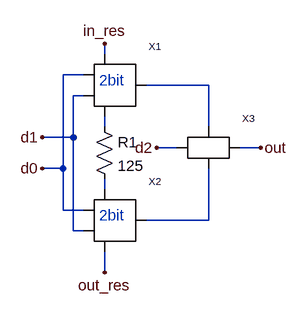
[diagram p0: schematic level2.asc]
level2.asc, the LTspice schematic file:
Version 4
SHEET 1 880 680
WIRE 144 64 144 48
WIRE 112 96 80 96
WIRE 304 112 208 112
WIRE 112 128 96 128
WIRE 144 176 144 160
WIRE 304 176 304 112
WIRE 96 192 96 128
WIRE 96 192 48 192
WIRE 256 208 224 208
WIRE 384 208 352 208
WIRE 80 240 80 96
WIRE 80 240 48 240
WIRE 144 272 144 256
WIRE 80 304 80 240
WIRE 112 304 80 304
WIRE 304 320 304 240
WIRE 304 320 208 320
WIRE 96 336 96 192
WIRE 112 336 96 336
WIRE 144 400 144 368
FLAG 144 48 in_res
FLAG 144 400 out_res
FLAG 384 208 out
FLAG 224 208 d2
FLAG 48 192 d1
FLAG 48 240 d0
SYMBOL level1 160 112 R0
SYMATTR InstName X1
SYMBOL level1 160 320 R0
SYMATTR InstName X2
SYMBOL switch 304 208 R0
SYMATTR InstName X3
SYMBOL res 128 160 R0
SYMATTR InstName R1
SYMATTR Value 125
TEXT 136 104 Left 2 ;2bit
TEXT 136 312 Left 2 ;2bit

The netlist it stands for:
* level2.asc
XX1 in_res N002 N001 d0 d1 level1  ; pins in_pin out_pin out_v d0 d1
XX2 N003 out_res N004 d0 d1 level1  ; pins in_pin out_pin out_v d0 d1
XX3 d2 N001 N004 out switch  ; pins dig_in in_1 in_2 Vout
R1 N002 N003 125
* 2bit
* 2bit
.backanno
.end